# EAGLE board Stepper motor board (EAGLE 9.6.2)
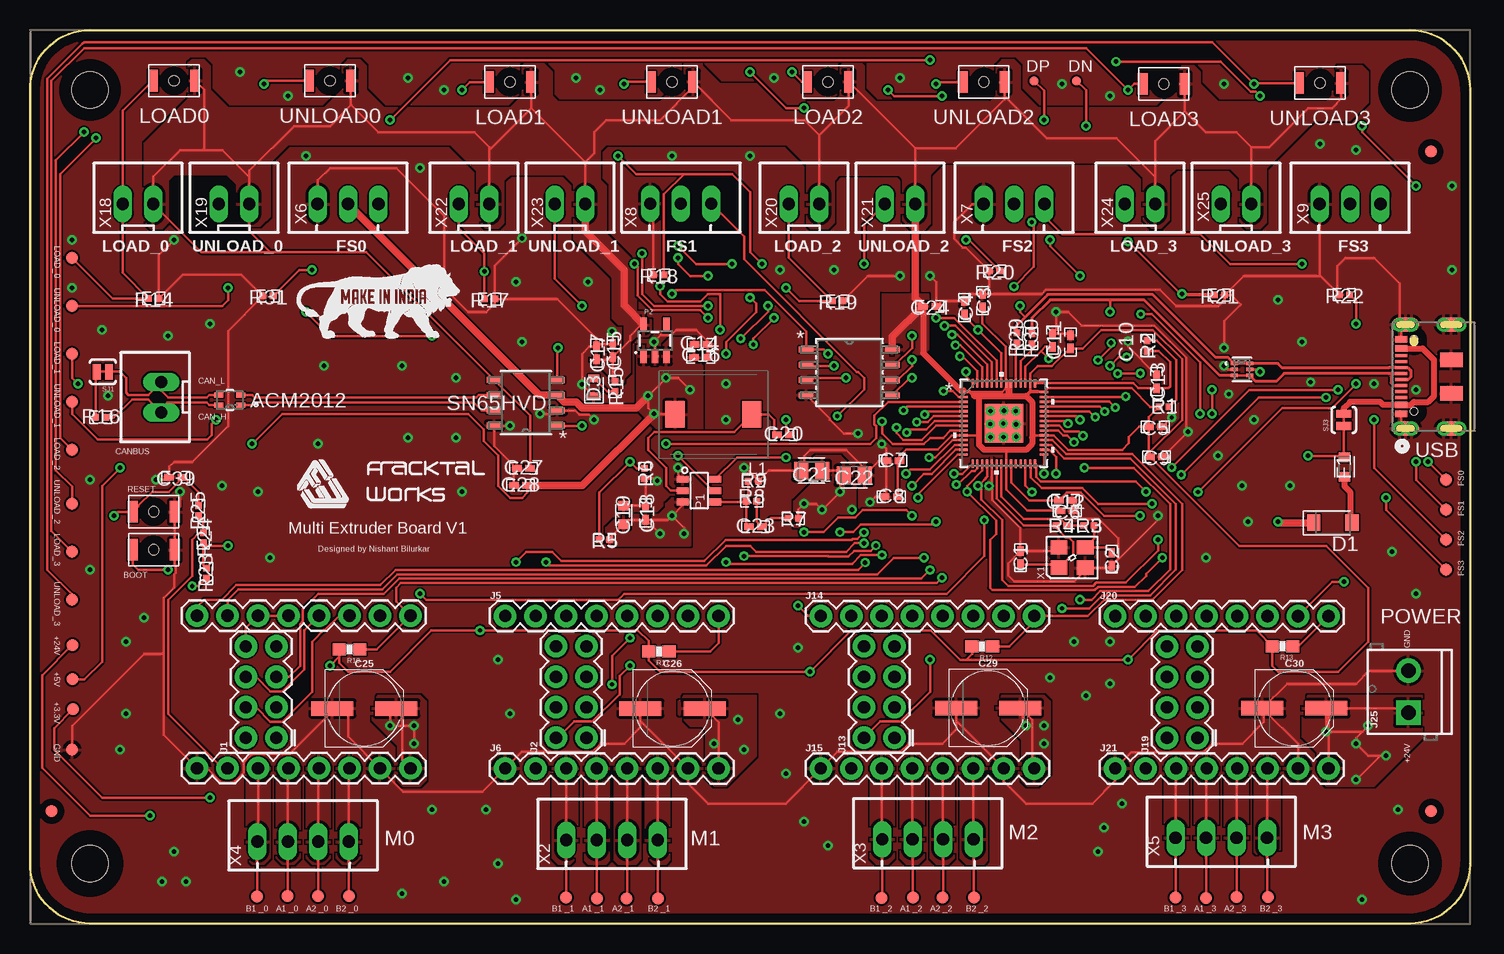
[diagram p2: board, top side]
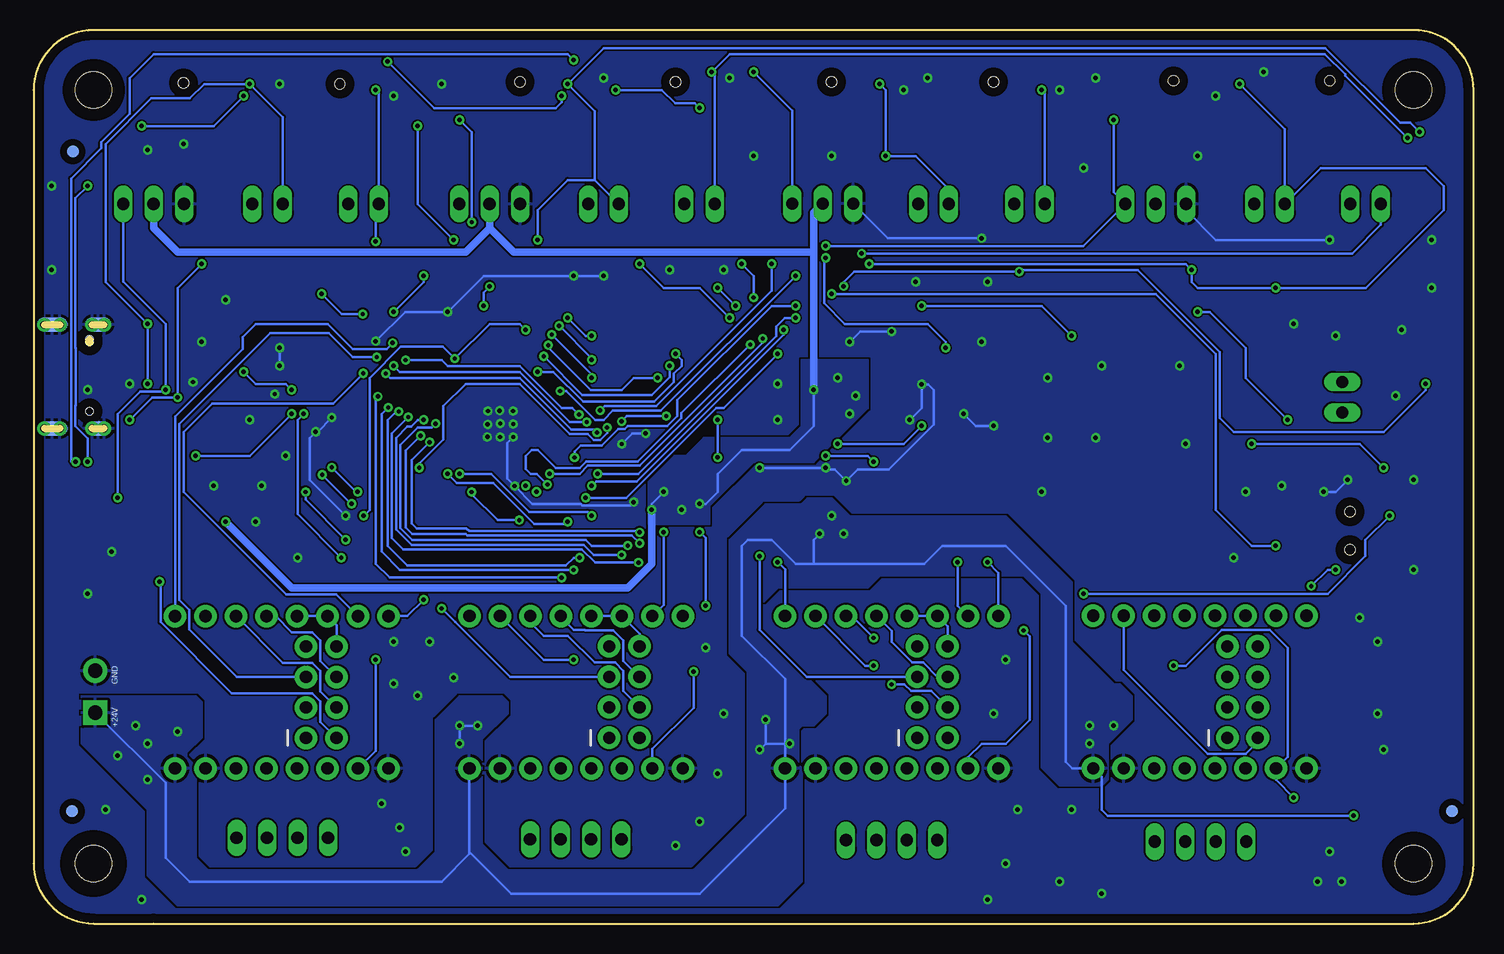
[diagram p3: board, bottom side, seen from below]

Size 120 x 74.5 mm. Coordinates in mm from the lower left corner, seen from the top.
Outline: 115,74.5 arc-90 120,69.5 120,5 arc-90 115,0 110,0 5,0 arc-90 0,5 0,69.5 arc-90 5,74.5 115,74.5
Copper layers (1*16): Top 0.035mm / dielectric 1.5mm / Bottom 0.035mm
Design rules "LionCircuits *": minimum track width 8mil, minimum drill 0.35mm, track to track 6mil, track to pad 6mil, pad to pad 6mil, via to via 6mil, smd to smd 6mil, copper to edge 30mil, drill to drill 10mil, minimum pad ring 10mil, minimum via ring 8mil, stop-mask expansion 4mil, vias tented up to drill 0mil, thermal gap 10mil
Holes 3 mm at 5,69.5 5,5 115,5 115,69.5
tRestrict: area 2.5,67 to 7.5,72; area 112.5,67 to 117.5,72; area 112.5,2.5 to 117.5,7.5; area 2.3,2.3 to 7.7,7.7
bRestrict: area 2.5,67 to 7.5,72; area 112.5,67 to 117.5,72; area 112.3,2.3 to 117.7,7.7; area 2.5,2.5 to 7.5,7.5

## Footprints (pad centres in the part's own frame; a part is rotated, then mirrored left to right if it is on the bottom)
PAD.03X.04 = smd 1.016 x 1.016: P$1 0,0
B3U-1000P(M)-B = smd 0.8 x 1.8: 1 -1.75,0; 2 1.75,0 | hole 0.85: 0,0
CAPC1005X60 = smd 0.79 x 0.54: 1 -0.55,0; 2 0.545,0
CAPC1608X85 = smd 0.8 x 0.9: 1 -0.775,0; 2 0.775,0
CAPC2012X110 = smd 1.165 x 1.465: 1 -0.875,0; 2 0.875,0
PANASONIC_D = smd 3.5 x 1.2: + 2.67,0; - -2.67,0
JST-XH-02-PACKAGE-LONG-PAD = drill 1.016 long: 1 -1.27,0; 2 1.27,0
SODFL3718X115 = smd 1.115 x 1.361: 1 -1.6,0; 2 1.6,0
SOT-666_STM-L = smd 0.583 x 0.28: 1 -0.66,0.5; 2 -0.66,0; 3 -0.66,-0.5; 4 0.66,-0.5; 5 0.66,0; 6 0.66,0.5
LEDC1608X35N_FLAT-G = smd 0.612 x 0.912: A 0.75,0; C -0.75,0
FUSC1608X60N = smd 0.799 x 0.974: 1 -0.815,0; 2 0.815,0
FIDUCIAL_1MM = smd 1 x 1: 1 0,0
PAD.03X.03 = smd 0.762 x 0.762: P$1 0,0
2X4 = drill 1.016 pad 1.88: 1 -3.81,-1.27; 2 -3.81,1.27; 3 -1.27,-1.27; 4 -1.27,1.27; 5 1.27,-1.27; 6 1.27,1.27; 7 3.81,-1.27; 8 3.81,1.27
1X08 = drill 1.016 pad 1.88: 1 0,0; 2 2.54,0; 3 5.08,0; 4 7.62,0; 5 10.16,0; 6 12.7,0; 7 15.24,0; 8 17.78,0
SCREWTERMINAL-3.5MM-2 = drill 1.2 pad 2.032 square: 1 0,0 | drill 1.2 pad 2.032: 2 3.5,0
SMDRI74-680MT = smd 1.6 x 2.2: 1 -3.2,0; 2 3.2,0
ACM2012_TDK = smd 0.762 x 0.406: 1 -0.925,0.406; 2 -0.925,-0.406; 3 0.925,-0.406; 4 0.925,0.406
SOT-23-6 = smd 1 x 0.55: 1 -1.35,0.95; 2 -1.35,0; 3 -1.35,-0.95; 4 1.35,-0.95; 5 1.35,0; 6 1.35,0.95
SOT23-5 = smd 0.55 x 1.2: 1 -0.95,-1.3; 2 0,-1.3; 3 0.95,-1.3; 4 0.95,1.3; 5 -0.95,1.3
RESC1005X40 = smd 0.566 x 0.54: 1 -0.433,0; 2 0.433,0
0603-RES = smd 1.1 x 1: 1 -0.85,0; 2 0.85,0
SJ_2S-TRACE = smd 0.635 x 1.27: 1 -0.508,0; 2 0.508,0
IC57_RP2040-L = smd 0.708 x 0.179: 1 -3.351,2.6; 2 -3.351,2.2; 3 -3.351,1.8; 4 -3.351,1.4; 5 -3.351,1; 6 -3.351,0.6; 7 -3.351,0.2; 8 -3.351,-0.2; 9 -3.351,-0.6; 10 -3.351,-1; 11 -3.351,-1.4; 12 -3.351,-1.8; 13 -3.351,-2.2; 14 -3.351,-2.6; 29 3.351,-2.6; 30 3.351,-2.2; 31 3.351,-1.8; 32 3.351,-1.4; 33 3.351,-1; 34 3.351,-0.6; 35 3.351,-0.2; 36 3.351,0.2; 37 3.351,0.6; 38 3.351,1; 39 3.351,1.4; 40 3.351,1.8; 41 3.351,2.2; 42 3.351,2.6 | smd 0.179 x 0.708: 15 -2.6,-3.351; 16 -2.2,-3.351; 17 -1.8,-3.351; 18 -1.4,-3.351; 19 -1,-3.351; 20 -0.6,-3.351; 21 -0.2,-3.351; 22 0.2,-3.351; 23 0.6,-3.351; 24 1,-3.351; 25 1.4,-3.351; 26 1.8,-3.351; 27 2.2,-3.351; 28 2.6,-3.351; 43 2.6,3.351; 44 2.2,3.351; 45 1.8,3.351; 46 1.4,3.351; 47 1,3.351; 48 0.6,3.351; 49 0.2,3.351; 50 -0.2,3.351; 51 -0.6,3.351; 52 -1,3.351; 53 -1.4,3.351; 54 -1.8,3.351; 55 -2.2,3.351; 56 -2.6,3.351 | smd 3.2 x 3.2: 57 0,0
SOIC_128JVSIQ_WIN-L = smd 1.213 x 0.483: 1 -3.595,1.905; 2 -3.595,0.635; 3 -3.595,-0.635; 4 -3.595,-1.905; 5 3.595,-1.905; 6 3.595,-0.635; 7 3.595,0.635; 8 3.595,1.905
D8-L = smd 1.255 x 0.508: 1 -2.621,1.905; 2 -2.621,0.635; 3 -2.621,-0.635; 4 -2.621,-1.905; 5 2.621,-1.905; 6 2.621,-0.635; 7 2.621,0.635; 8 2.621,1.905
CONN12_KH-TYPE-C-16P = smd 0.52 x 1: 1 -3.1,1.1; 2 -2.35,1.1; 11 2.35,1.1; 12 3.1,1.1 | smd 0.27 x 1: 3 -1.75,1.1; 4 -1.25,1.1; 5 -0.75,1.1; 6 -0.25,1.1; 7 0.25,1.1; 8 0.75,1.1; 9 1.25,1.1; 10 1.75,1.1 | smd 1.2 x 2.2: 13 -4.32,0.725; 14 4.32,0.725 | smd 1.2 x 2.5: 15 -4.32,-3.1; 16 4.32,-3.1 | smd 1.2 x 1.9: 18 -1.4,-3.1; 19 1.4,-3.1 | drill 0.65 pad 0.65: 20 -4.32,1.225; 21 -4.32,0.225; 24 4.32,1.225; 25 4.32,0.225; 26 4.32,-2.45; 27 4.32,-3.75; 28 -4.32,-2.45; 29 -4.32,-3.75 | smd 1.2 x 2.5 bottom: 37 -4.32,-3.1; 41 4.32,-3.1 | smd 1.2 x 2.2 bottom: 39 -4.32,0.725; 43 4.32,0.725 | hole 0.6: -2.9,0; 3.125,0; 2.875,0
CRYSTAL_3225 = smd 1.4 x 1.2: P$1 -1.1,-0.85; P$2 1.1,-0.85; P$3 1.1,0.85; P$4 -1.1,0.85
JST-XH-04-PACKAGE-LONG-PAD = drill 1.016 long: 1 -3.81,0; 2 -1.27,0; 3 1.27,0; 4 3.81,0
JST-XH-03-PACKAGE-LONG-PAD = drill 1.016 long: 1 -2.54,0; 2 0,0; 3 2.54,0

## Placement (x,y rotation side)
1A_0  TEST-POINT3X4  [PAD.03X.04]  21.47,2.29 180 top
1A_1  TEST-POINT3X4  [PAD.03X.04]  47.24,2.08 0 top
1A_2  TEST-POINT3X4  [PAD.03X.04]  73.57,2.15 0 top
1A_3  TEST-POINT3X4  [PAD.03X.04]  98.01,2.13 0 top
1B_0  TEST-POINT3X4  [PAD.03X.04]  18.92,2.25 180 top
1B_1  TEST-POINT3X4  [PAD.03X.04]  44.67,2.16 0 top
1B_2  TEST-POINT3X4  [PAD.03X.04]  70.98,2.12 0 top
1B_3  TEST-POINT3X4  [PAD.03X.04]  95.47,2.15 0 top
2A_0  TEST-POINT3X4  [PAD.03X.04]  24.01,2.29 180 top
2A_1  TEST-POINT3X4  [PAD.03X.04]  49.7,2.08 0 top
2A_2  TEST-POINT3X4  [PAD.03X.04]  76.03,2.15 0 top
2A_3  TEST-POINT3X4  [PAD.03X.04]  100.53,2.22 0 top
2B_0  TEST-POINT3X4  [PAD.03X.04]  26.59,2.29 180 top
2B_1  TEST-POINT3X4  [PAD.03X.04]  52.32,2.08 0 top
2B_2  TEST-POINT3X4  [PAD.03X.04]  78.65,2.15 0 top
2B_3  TEST-POINT3X4  [PAD.03X.04]  103.15,2.22 0 top
3.3V  TEST-POINT3X4  [PAD.03X.04]  3.57,17.86 0 top
5V  TEST-POINT3X4  [PAD.03X.04]  3.53,20.36 0 top
24V  TEST-POINT3X4  [PAD.03X.04]  3.53,23.21 0 top
BOOT  B3U-1000P(M)-B  [B3U-1000P(M)-B]  10.31,31.16 180 top
C1  30pF  [CAPC1005X60]  82.53,30.5 90 top
C2  30pF  [CAPC1005X60]  90.15,30.38 90 top
C3  1uF  [CAPC1005X60]  79.37,51.94 90 top
C4  1uF  [CAPC1005X60]  77.87,51.36 90 top
C5  100nF  [CAPC1005X60]  93.78,41.43 0 top
C6  100nF  [CAPC1005X60]  86.43,34.43 0 top
C7  100nF  [CAPC1005X60]  71.92,38.57 180 top
C8  100nF  [CAPC1005X60]  71.77,35.57 180 top
C9  100nF  [CAPC1005X60]  93.88,38.93 0 top
C10  100nF  [CAPC1005X60]  86.72,48.49 90 top
C11  100nF  [CAPC1005X60]  85.22,48.64 90 top
C12  100nF  [CAPC1005X60]  86.29,35.28 0 top
C13  1uF  [CAPC1005X60]  93.87,45.18 90 top
C14  1uF  [CAPC1005X60]  55.92,48.29 0 top
C15  1uF  [CAPC1005X60]  48.56,47.77 90 top
C16  100nF  [CAPC1005X60]  55.9,47.2 0 top
C17  100nF  [CAPC1005X60]  47.19,47.58 90 top
C18  100nF  [CAPC1005X60]  51.31,34.22 90 top
C19  10uF  [CAPC1608X85]  49.47,34.07 90 top
C20  100nF  [CAPC1005X60]  62.78,40.77 180 top
C21  22uF  [CAPC2012X110]  65.14,37.76 180 top
C22  22uF  [CAPC2012X110]  68.67,37.37 0 top
C23  75pF  [CAPC1005X60]  60.46,33.09 180 top
C24  100nF  [CAPC1005X60]  74.98,51.47 0 top
C25  100uF  [PANASONIC_D]  27.86,17.93 0 top
C26  100uF  [PANASONIC_D]  53.54,17.93 0 top
C27  100nF  [CAPC1005X60]  41.13,37.95 180 top
C28  100nF  [CAPC1005X60]  40.87,36.53 180 top
C29  100uF  [PANASONIC_D]  79.84,17.96 0 top
C30  100uF  [PANASONIC_D]  105.37,17.94 0 top
C39  100nF  [CAPC1005X60]  12.15,37.21 0 top
CANBUS  JST-XH-02-PIN-LONG-PAD  [JST-XH-02-PACKAGE-LONG-PAD]  10.94,43.88 90 top
D1  MBR0520LT1G  [SODFL3718X115]  108.58,33.41 0 top
D2  USBLC6-2P6SOT-666_STM-L  [SOT-666_STM-L]  101,46.2 0 top
D3  LED_G  [LEDC1608X35N_FLAT-G]  46.99,44.72 90 top
F1  FUSE_CHIP-0603(1608-METRIC)  [FUSC1608X60N]  109.54,38.07 90 top
FD1  FIDUCIAL  [FIDUCIAL_1MM]  1.81,9.36 0 top
FD2  FIDUCIAL  [FIDUCIAL_1MM]  116.77,9.36 0 top
FD3  FIDUCIAL  [FIDUCIAL_1MM]  116.73,64.36 0 top
FD4  FIDUCIAL  [FIDUCIAL_1MM]  1.81,9.36 0 bottom
FD5  FIDUCIAL  [FIDUCIAL_1MM]  116.78,9.36 0 bottom
FD6  FIDUCIAL  [FIDUCIAL_1MM]  116.73,64.37 0 bottom
FS0  TEST-POINT3X4  [PAD.03X.04]  118,37 0 top
FS1  TEST-POINT3X4  [PAD.03X.04]  118,34.5 0 top
FS2  TEST-POINT3X4  [PAD.03X.04]  118,32 0 top
FS3  TEST-POINT3X4  [PAD.03X.04]  118,29.5 0 top
GND  TEST-POINT3X4  [PAD.03X.04]  3.5,14.5 0 top
IO1  TEST-POINT3  [PAD.03X.03]  83.66,70.26 0 top
IO2  TEST-POINT3  [PAD.03X.03]  87.2,70.26 0 top
J1  [2X4]  19.26,19.29 90 top
J2  [2X4]  45.1,19.3 90 top
J3  [1X08]  13.92,25.66 0 top
J4  [1X08]  13.92,12.94 0 top
J5  [1X08]  39.6,25.64 0 top
J6  [1X08]  39.6,12.93 0 top
J13  [2X4]  70.77,19.3 90 top
J14  [1X08]  65.9,25.64 0 top
J15  [1X08]  65.9,12.93 0 top
J19  [2X4]  96.02,19.28 90 top
J20  [1X08]  90.43,25.63 0 top
J21  [1X08]  90.43,12.93 0 top
J25  [SCREWTERMINAL-3.5MM-2]  114.86,17.57 90 top
L1  ASPI-0630HI-100M-T157X7X4  [SMDRI74-680MT]  56.95,42.45 180 top
L2  ACM2012  [ACM2012_TDK]  16.65,43.65 180 top
LOAD0  B3U-1000P(M)-B  [B3U-1000P(M)-B]  11.99,70.27 0 top
LOAD1  B3U-1000P(M)-B  [B3U-1000P(M)-B]  40.01,70.16 0 top
LOAD2  B3U-1000P(M)-B  [B3U-1000P(M)-B]  66.49,70.18 0 top
LOAD3  B3U-1000P(M)-B  [B3U-1000P(M)-B]  94.48,70 0 top
LOAD_0  TEST-POINT3X4  [PAD.03X.04]  3.5,55.5 0 top
LOAD_1  TEST-POINT3X4  [PAD.03X.04]  3.5,47.5 0 top
LOAD_2  TEST-POINT3X4  [PAD.03X.04]  3.5,39.5 0 top
LOAD_3  TEST-POINT3X4  [PAD.03X.04]  3.5,31 0 top
P1  TPS54202_BUCKCONV  [SOT-23-6]  55.76,36.09 0 top
P2  3.3V  [SOT23-5]  52.09,48.61 0 top
R1  200R  [RESC1005X40]  94.51,43.07 180 top
R2  1R  [RESC1005X40]  93.07,48.17 90 top
R3  1K  [RESC1005X40]  88.24,33.19 180 top
R4  NO-FIT  [RESC1005X40]  85.95,33.19 180 top
R5  511k  [RESC1005X40]  47.87,32 0 top
R6  105k  [RESC1005X40]  51.22,37.52 90 top
R7  49.9R  [RESC1005X40]  63.61,33.8 0 top
R8  100k  [RESC1005X40]  60.13,35.23 0 top
R9  13.3k  [RESC1005X40]  60.28,36.89 180 top
R10  10K  [0603-RES]  26.62,22.86 180 top
R11  10K  [0603-RES]  52.4,22.68 180 top
R12  10K  [0603-RES]  79.35,23.09 180 top
R13  10K  [0603-RES]  104.38,23.12 180 top
R14  10K  [RESC1005X40]  10.3,52.12 0 top
R15  49.9R  [RESC1005X40]  48.74,44.78 90 top
R16  120R  [RESC1005X40]  5.89,42.2 180 top
R17  10K  [RESC1005X40]  38.3,52.07 0 top
R18  10k  [RESC1005X40]  52.38,54.07 0 top
R19  10K  [RESC1005X40]  67.3,51.9 0 top
R20  10k  [RESC1005X40]  80.38,54.4 0 top
R21  10K  [RESC1005X40]  99.12,52.4 0 top
R22  10k  [RESC1005X40]  109.53,52.43 0 top
R23  1K  [RESC1005X40]  14.71,29.2 270 top
R24  DO NOT FIT (10K)  [RESC1005X40]  14.44,32.15 90 top
R25  100k  [RESC1005X40]  14.06,34.42 270 top
R29  27.4R  [RESC1005X40]  82.24,48.83 270 top
R30  27.4R  [RESC1005X40]  83.49,48.76 270 top
R31  10k  [RESC1005X40]  19.84,52.32 0 top
RESET  B3U-1000P(M)-B  [B3U-1000P(M)-B]  10.31,34.32 180 top
SJ1  SOLDERJUMPERTRACE  [SJ_2S-TRACE]  6.07,46 180 top
SJ3  SOLDERJUMPERTRACE  [SJ_2S-TRACE]  109.49,41.99 90 top
U1  RP2040IC57_RP2040-L  [IC57_RP2040-L]  81.15,41.7 0 top
U2  W25Q128JVSIQSOIC_128JVSIQ_WIN-L  [SOIC_128JVSIQ_WIN-L]  68.28,45.95 0 top
U3  SN65HVD  [D8-L]  41.32,43.42 180 top
U$2  [MAKEININDIA]  23.21,48.08 0 top
U$3  [FWLOGO_SMALL]  22,33.5 0 top
UNLOAD0  B3U-1000P(M)-B  [B3U-1000P(M)-B]  25,70.27 0 top
UNLOAD1  B3U-1000P(M)-B  [B3U-1000P(M)-B]  53.51,70.17 0 top
UNLOAD2  B3U-1000P(M)-B  [B3U-1000P(M)-B]  79.48,70.17 0 top
UNLOAD3  B3U-1000P(M)-B  [B3U-1000P(M)-B]  107.52,70.08 0 top
UNLOAD_0  TEST-POINT3X4  [PAD.03X.04]  3.5,51.5 0 top
UNLOAD_1  TEST-POINT3X4  [PAD.03X.04]  3.5,43.5 0 top
UNLOAD_2  TEST-POINT3X4  [PAD.03X.04]  3.5,35 0 top
UNLOAD_3  TEST-POINT3X4  [PAD.03X.04]  3.5,27 0 top
USB  USB-C(KH-TYPE-C-16P)  [CONN12_KH-TYPE-C-16P]  115.35,45.6 90 top
X1  CRYSTAL_TAXM12M4RLBDDT2T_3225  [CRYSTAL_3225]  86.84,30.5 0 top
X2  JST-XH-04-PIN-LONG-PAD  [JST-XH-04-PACKAGE-LONG-PAD]  48.49,6.95 0 top
X3  JST-XH-04-PIN-LONG-PAD  [JST-XH-04-PACKAGE-LONG-PAD]  74.82,7.02 0 top
X4  JST-XH-04-PIN-LONG-PAD  [JST-XH-04-PACKAGE-LONG-PAD]  22.76,6.83 0 top
X5  JST-XH-04-PIN-LONG-PAD  [JST-XH-04-PACKAGE-LONG-PAD]  99.28,7.14 0 top
X6  JST-XH-03-PIN-LONG-PAD  [JST-XH-03-PACKAGE-LONG-PAD]  26.5,60 0 top
X7  JST-XH-03-PIN-LONG-PAD  [JST-XH-03-PACKAGE-LONG-PAD]  82,60 0 top
X8  JST-XH-03-PIN-LONG-PAD  [JST-XH-03-PACKAGE-LONG-PAD]  54.24,60.01 0 top
X9  JST-XH-03-PIN-LONG-PAD  [JST-XH-03-PACKAGE-LONG-PAD]  110,60 0 top
X18  JST-XH-02-PIN-LONG-PAD  [JST-XH-02-PACKAGE-LONG-PAD]  9,60 0 top
X19  JST-XH-02-PIN-LONG-PAD  [JST-XH-02-PACKAGE-LONG-PAD]  17,60 0 top
X20  JST-XH-02-PIN-LONG-PAD  [JST-XH-02-PACKAGE-LONG-PAD]  64.5,60 0 top
X21  JST-XH-02-PIN-LONG-PAD  [JST-XH-02-PACKAGE-LONG-PAD]  72.5,60 0 top
X22  JST-XH-02-PIN-LONG-PAD  [JST-XH-02-PACKAGE-LONG-PAD]  37,60 0 top
X23  JST-XH-02-PIN-LONG-PAD  [JST-XH-02-PACKAGE-LONG-PAD]  45,60 0 top
X24  JST-XH-02-PIN-LONG-PAD  [JST-XH-02-PACKAGE-LONG-PAD]  92.5,60 0 top
X25  JST-XH-02-PIN-LONG-PAD  [JST-XH-02-PACKAGE-LONG-PAD]  100.5,60 0 top

## Tracks (layer width: path | path; a pad name or v marks a point on that pad's centre or on a via)
1A_0
  Top 0.203: 1A_0.P$1 21.49,2.32 X4.2 21.49,12.89 J4.4
  pour Top: 22,14 21,14 20.5,13.5 20.5,5.5 21,5 22,5 22.5,5.5 22.5,13.5
1A_1
  Top 0.203: 1A_1.P$1 47.22,2.09 X2.2 J6.4
  pour Top: 48,14 46.86,14 46.24,13.37 46.24,5.26 46.5,5 48,5 48.28,5.28 48.28,13.72
1A_2
  Top 0.203: 1A_2.P$1 73.55,2.17 X3.2 73.52,7.04 J15.4
  pour Top: 74,14 73,14 72.5,13.5 72.5,5.5 73,5 74,5 74.5,5.5 74.5,13.5
1A_3
  Top 0.203: 1A_3.P$1 X5.2 98,12.88 J21.4
  pour Top: 98.5,14 97.5,14 97,13.5 97,6 97.5,5.5 98.5,5.5 99,6 99,13.5
1B_0
  Top 0.203: 1B_0.P$1 18.95,2.28 X4.1 19,6.88 J4.3
  pour Top: 19.5,14 18.5,14 18,13.5 18,5.5 18.5,5 19.5,5 20,5.5 20,13.5
1B_1
  Top 0.203: 1B_1.P$1 44.68,2.18 X2.1 J6.3
  pour Top: 45,14 44,14 43.5,13.5 43.5,5.5 44,5 45,5 45.65,5.65 45.65,13.35
1B_2
  Top 0.203: 1B_2.P$1 71.01,2.15 X3.1 70.98,7.04 J15.3
  pour Top: 71.5,14 70.5,14 70,13.5 70,5.5 70.5,5 71.5,5 72,5.5 72,13.5
1B_3
  Top 0.203: 1B_3.P$1 X5.1 95.47,12.88 J21.3
  pour Top: 96,14 95,14 94.5,13.5 94.5,6 95,5.5 96,5.5 96.5,6 96.5,13.5
2A_0
  Top 0.203: 2A_0.P$1 24.03,2.32 X4.3 24.03,12.89 J4.5
  pour Top: 24.5,14 23.5,14 23,13.5 23,5.5 23.5,5 24.5,5 25,5.5 25,13.5
2A_1
  Top 0.203: 2A_1.P$1 49.76,2.15 X2.3 J6.5
  pour Top: 50.5,14 49,14 48.67,13.67 48.67,5.33 49,5 50.5,5 50.89,5.39 50.89,13.61
2A_2
  Top 0.203: 2A_2.P$1 76.09,2.21 X3.3 76.06,7.04 J15.5
  pour Top: 76.5,14 75.5,14 75,13.5 75,5.5 75.5,5 76.5,5 77,5.5 77,13.5
2A_3
  Top 0.203: 2A_3.P$1 100.55,2.24 X5.3 100.55,12.88 J21.5
  pour Top: 101,14 100,14 99.5,13.5 99.5,6 100,5.5 101,5.5 101.5,6 101.5,13.5
2B_0
  Top 0.203: 2B_0.P$1 26.57,2.3 X4.4 26.57,12.89 J4.6
  pour Top: 27,14 26,14 25.5,13.5 25.5,5.5 26,5 27,5 27.5,5.5 27.5,13.5
2B_1
  Top 0.203: 2B_1.P$1 52.3,2.09 X2.4 J6.6
  pour Top: 53,14 51.5,14 51.26,13.76 51.26,5.74 52,5 53,5 53.29,5.29 53.29,13.71
2B_2
  Top 0.203: 2B_2.P$1 78.63,2.17 X3.4 78.6,7.04 J15.6
  pour Top: 79.5,14 78,14 77.5,13.5 77.5,5.5 78,5 79.5,5 79.79,5.29 79.79,13.71
2B_3
  Top 0.203: 2B_3.P$1 103.08,2.29 X5.4 103.08,12.88 J21.6
  pour Top: 103.5,14 102.5,14 102,13.5 102,6 102.5,5.5 103.5,5.5 104.2,6.2 104.2,13.3
+1.1V  (via drill 0.35)
  Top 0.203: U1.45 82.95,46.45 84.25,47.75 | C11.1 84.59,48.09 84.25,47.75 | U1.50 80.95,47.55 v79,49.5 77.87,50.63 C4.1 | U1.23 81.75,36.79 83.26,35.28 C12.1 86.4,35.94 87.56,35.94 89.5,34 v92.5,34 | v84.9,47.1 84.25,47.75
  Bottom 0.203: v79,49.5 79.5,50 82,50 v84.9,47.1 85.9,48.1 89.4,48.1 92,45.5 92,34.5 v92.5,34
+3.3V  (via drill 0.35)
  Top 0.203: 83.5,40.5 83.7,40.7 U1.33 85.3,40.7 86.5,39.5 91,39.5 91.54,40.04 91.54,40.54 92.43,41.43 C5.1 | 81.5,39.5 81.35,39.35 U1.22 81.35,37.69 81.35,36.19 83.11,34.43 C6.1 | 79.09,40.41 78.8,40.7 U1.10 76.8,40.7 75.63,39.53 73.03,39.53 72.45,38.95 72.45,38.55 | C3.1 79.37,50.02 81.31,48.09 81.31,45.39 81.64,45.06 | U1.49 81.45,44.96 | U1.48 | U1.48 81.64,45.06 | C5.1 93.23,39.03 C9.1 | C8.1 72.32,38.42 72.45,38.55 | 72.45,38.55 C7.1 | C5.1 93.23,42.22 R1.2 93.37,43.07 91.81,44.63 84.83,44.63 U1.42 84.46,44.35 84,44.35 | C9.1 93.33,39.33 96,42 96,47.04 93.54,49.5 89.28,49.5 87.72,47.94 C10.1 86.64,47.94 85.16,46.47 83.97,46.47 83.35,45.85 U1.44 83.35,44.49 83.5,44.35 | C9.1 100.76,31.5 108,31.5 111.5,28 111.5,23.5 109,21 104,21 103.53,21.47 R13.2 102.22,24.44 93.94,24.44 v91.5,22 78,22 | 78,22 77.5,22 75.05,24.45 68.45,24.45 v65,21 52.5,21 51.55,21.95 R11.2 51.55,23.55 50.65,24.45 v37.5,24.45 33.45,24.45 30,21 26.5,21 25.77,21.73 R10.2 25.77,22.27 v25,21.5 | 78,22 78.5,22.5 R12.2 | C27.1 41.68,42.35 U3.5 28.03,56 20,56 | R25.2 14.44,33.61 R24.2 14.08,32.58 13.5,32 13.5,29 11.5,27 11.5,17.5 16.06,12.94 J4.2 | 20,56 18.27,57.73 X19.2 18.27,62.23 | 20,56 14.27,56 X18.2 10.27,62.27 12.5,64.5 14.5,64.5 | 14.5,64.5 16,64.5 18.27,62.23 | 18.27,62.23 18.27,62.77 22,66.5 25,66.5 26.75,68.25 | LOAD0.2 14.5,69.51 14.5,64.5 | 26.75,68.25 UNLOAD0.2 | 26.75,68.25 29,66 37,66 38.27,64.73 38.27,64.5 | 38.27,64.5 X22.2 | 38.27,64.5 41.76,67.99 41.76,68 | 41.76,68 LOAD1.2 | 41.76,68 46.27,63.49 | 46.27,63.49 X23.2 | 46.27,63.49 47,64.22 47,66 48,67 52.5,67 55.26,69.76 UNLOAD1.2 58.43,67 64.5,67 65.77,65.73
  Top 0.203: 65.77,65.73 X20.2 | 65.77,65.73 68.24,68.2 LOAD2.2 73.77,64.66 | 73.77,64.66 X21.2 | 73.77,64.66 77.16,64.66 81.23,68.73 81.23,69 | 81.23,69 UNLOAD2.2 | 81.23,69 84.73,65.5 90.5,65.5 93.75,62.25 | 93.75,62.25 93.77,62.23 X24.2 | 93.75,62.25 93.75,65.25 96.23,67.73 | LOAD3.2 96.23,67.73 | 96.23,67.73 97.97,66 100.5,66 101.75,64.75 | 101.75,64.75 101.77,64.73 X25.2 | 101.75,64.75 103.25,64.75 106.5,68 108.5,68 109.27,68.77 UNLOAD3.2 | 3.3V.P$1 2,16.29 2,14.5 6,10.5 v15,10.5 | 77.8,44.45 77.7,44.35 77.65,44.35 | 81.64,45.06 81.3,44.71 81.3,44.6 81,44.3 U1.1 | C17.1 48.36,47.02 C15.1 | C15.1 48.56,45.4 R15.2 | C15.1 50,48.66 50,49 50.91,49.91 P2.5
  Top 0.305: 84,44.35 83.5,44.35 83.36,44.35 83.35,44.35 83,44 | 78.65,44 78.3,44.35 77.65,44.35 77.55,44.45
  Top 0.406: 81.45,44.96 81.5,44.91 81.5,44 81.64,44.14 81.64,45.06
  Top 0.508: C24.1 74.43,47.57 77.55,44.45 77.8,44.45 | 79,44 81.5,44 83,44 83.5,43.5 83.5,40.5 83.5,40 83,39.5 81.5,39.5 79.51,39.5 79.09,39.91 79.09,40.41 79.09,43.91 79,44 | 78.65,44 79,44
  Top 0.61: P2.5 49.5,51.55 49.5,54.5 46.27,57.73 X23.2 | X21.2 73.77,52.13 C24.1 71.88,48.92 U2.8
  Bottom 0.203: v25,21.5 24,21.5 21,24.5 19.53,24.5 19.5,24.47 16.97,24.47 15.5,23 15.5,13.9 J4.2 16.46,11.96 v15,10.5 | v37.5,24.45 37,23.95 37,17 39,15 41,15 42.14,13.86 J6.2 | v65,21 65,18 68.44,14.56 J15.2 | v91.5,22 91.5,14.4 J21.2
  pour Top: 47,46.5 47.5,46.5 48.31,45.69 48.31,44.96 48.47,44.8 49.12,44.8 49.5,45.18 49.5,45.5 50,46 50,48.5 50.5,49 51.5,49 51.77,49.27 51.77,50.33 51.1,51 50.5,51 49.5,50 49.5,48 49.19,47.69 48.3,47.69 48.1,47.49 46.86,47.49 46.69,47.32 46.69,46.61 46.8,46.5 47,46.5 47,46.5
  pour Top: 13.5,72 13.18,71.68 13.18,68.72 9.5,65.04 9.5,58.5 10,58 11,58 11.5,58.5 11.5,62 12,62.5 16.4,62.5 17.25,61.66 17.25,58.84 17.91,58.18 19.18,58.18 20,59 20,63.5 21.5,65 35,65 37.22,62.78 37.22,58.76 37.95,58.02 39.05,58.02 39.46,58.44 39.46,61.96 40,62.5 44.5,62.5 45.3,61.7 45.3,58.67 45.98,58 46.5,58 47.5,59 47.5,64.5 48,65 63,65 64.72,63.28 64.72,58.3 65.02,58 66.5,58 67,58.5 67,62 67.42,62.42 72.39,62.42 72.72,62.09 72.72,58.66 73.51,57.87 74.52,57.87 75.03,58.38 75.03,62.47 75,62.5 76,63.5 91.5,63.5 92.79,62.21 92.79,58.68 93.42,58.04 94.26,58.04 94.92,58.7 94.92,62.42 95.5,63 100,63 100.8,62.2 100.8,58.56 101.36,58 102.5,58 103,58.5 103,63 107,67 110,67 111.5,68.5 111.5,71 111,71.5 109,71.5 108.5,71 108.5,69 108,68.5 99,68.5 97.5,70 97.5,71 97,71.5 96,71.5 95.5,71 95.5,69.5 94,68 84,68 82.5,69.5 82.5,71.5 82,72 81,72 80.5,71.5 80.5,69 80,68.5 70.5,68.5 69.5,69.5 69.5,71.5 69,72 68,72 67.5,71.5 67.5,69 67,68.5 64,68.5 62.5,70 57.5,70 56,71.5 56,72 55.5,72.5 55,72.5 54.5,72 54.5,70.5 52.5,68.5 44,68.5 43.5,69 43.5,71 42.5,72 41.5,72 41,71.5 41,69 40,68 29.5,68 28,69.5 28,71.5 27.5,72 26.5,72 26,71.5 26,69.5 24.5,68 16.5,68 15,69.5 15,71.5 14.5,72
  pour Top: 49.5,50 50.5,51 50.5,55 48,57.5 48,61.5 47,62.5 46,62.5 45.3,61.8 45.3,59.76 45.3,57.08 45.48,56.91 48.5,53.89 48.5,51.5 48.5,50.5 49,50
  pour Top: 71,52.5 71,47.5 74.5,47.5 74.89,47.89 74.89,52.42
+5V  (via drill 0.35)
  Top 0.203: 5V.P$1 4.53,20.36 6,21.83 6,36.5 v7.5,38 | R7.2 64.04,34.54 v64.5,35 65.5,35 v66,34.5 v67.5,36 67.5,37.08 67.71,37.29 | 67.71,37.29 C22.1 | C21.1 67.24,37.76 67.71,37.29 | L1.2 53.7,42.5 v52,42.5 51.5,43 v51.5,44 v53,45.5 54,45.5 v55,44.5 | v18.5,40 21,42.5 36.5,42.5 37.82,41.18 37.82,40.21 39,39.03 39,36.5 40,35.5 41,35.5 41.42,35.92 C28.1
  Top 0.61: D1.1 104.09,33.41 v104,33.5 | X6.2 27.77,58.73 27.77,58.71 42.42,44.06 U3.3 44.5,43.5 45.5,43.5 46,43 50.5,43 v51.5,44 | v52,42.5 46.03,36.53 C28.1
  Bottom 0.203: v7.5,38 9.5,40 v18.5,40 | v55,44.5 55,41.5 57,39.5 61,39.5 63,37.5 63,36 64,35 v64.5,35 | v67.5,36 68.5,35 v68.5,34.5
  Bottom 0.61: v104,33.5 98.5,28 70.5,28 68.5,30 v68.5,34.5 | v55,44.5 55,56 | 55,56 55,59.25 X8.2 | 55,56 80,56 82,58 | 82,58 X7.2 | 82,58 84,56 108,56 110,58 X9.2
  pour Top: 55.91,46.56 55.91,48.74 55.83,48.82 53.35,48.82 52.68,48.15 52.68,46.6 52.36,46.28 51.68,46.28 51.54,46.42 51.54,48.1 51.57,48.13 50.62,48.13 50.62,42.88 53,40.5 56,40.5 56,46.5
  pour Bottom: 56,47 50.5,47 50.5,43 55,38.5 60,38.5 63.7,34.8 63.7,33.3 68.75,33.3 68.75,37.25 67,39 65.67,39 64.17,40.5 57,40.5 56,41.5
  pour Top: 65.5,39 65.33,38.83 65.33,36.83 63.68,35.18 63.68,33.07 68.77,33.07 68.77,36.73 68.5,37 68.5,38 67.5,39
+24V  (via drill 0.35)
  Top 0.203: J21.8 108.21,17.77 C30.+ | C30.+ 114.49,17.94 J25.1 | J15.8 83.51,13.1 83.51,16.96 82.73,17.73 | 82.73,17.73 C29.+ | C26.+ 57.38,16.76 J6.8 57.38,14.62 v57,15 | J4.8 31,13.64 31,17.46 C25.+ 30,17.4 v30,16.5 v32,16.5 v32,15 | R5.2 48.31,32.13 C19.1 49.84,33.67 C18.1 | C18.1 53.17,33.67 v53.5,34 | v53.5,34 54.41,34.91 P1.3 | v53.5,34 54.5,33 v54.5,32.5 | v52.5,32.5 51.33,33.67 C18.1 | v83,16.5 82.73,16.77 82.73,17.73 | v110.5,12 112.5,14 v113,14 111.5,14 v110.5,15 110.5,15.5 v111.5,16.5 111,16 v108,16 108.04,16.04 C30.+ | 24V.P$1 1,20.68 1,13 5,9 v10,9
  Bottom 0.203: J25.1 109,11.71 109,5.5 107,3.5 86,3.5 83.68,5.82 83.68,6 | 83.68,6 J15.8 | 83.68,6 80.18,2.5 64.5,2.5 57.38,9.62 J6.8 57.38,20.38 61,24 61,31.5 60.5,32 58.5,32 56.5,30 55,30 | 55,30 45.77,30 44.27,31.5 39,31.5 34,26.5 34,13.5 33.44,12.94 J4.8 31,12.24 31,9.5 30.5,9 v10,9 | v54.5,32.5 55,32 55,30 | v57,15 59,15 | v59.5,14.5 59,15 | 59,15 v59,17 | v83,16.5 v84.5,16.5 v84.5,15
  pour Top: 116,19 106.5,19 106,18.5 106,15.6 107.29,14.31 107.29,12.21 108,11.5 112,11.5 116,15.5
  pour Top: 84.5,19 81,19 80.5,18.5 80.5,17.5 82.64,15.36 82.64,11.95 83.09,11.5 84,11.5 85,12.5 85,18.5
  pour Top: 60.5,19 54.5,19 54,18.5 54,17.5 55,16.5 56,16.5 56.31,16.19 56.31,12.19 57,11.5 58,11.5 60.5,14
  pour Top: 32.5,19 29,19 28.5,18.5 28.5,17 30.65,14.85 30.65,11.85 31,11.5 32.5,11.5 33,12 33,18.5
  pour Top: 55,31.5 48,31.5 48,33 49,34 50,34 50.1,34.1 52.42,34.1 53,34.68 53,35 53.5,35.5 55,35.5
  pour Bottom: 30.5,15 30.5,12 31,11.5 34.5,11.5 36,13 36,27.5 37.5,29 49.5,29 50.5,28 54,28 55.5,29.5 55.5,34 56,34.5 56,35 55.5,35.5 53.5,35.5 52,34 39,34 33.5,28.5 33.5,23.5 30,20 29.5,20 28.5,19 28.5,17
  pour Bottom: 54,28 58,28 59.5,26.5 59.5,24.5 54,19 54,17.5 55,16.5 56,16.5 56.3,16.2 56.3,12.05 56.85,11.5 58.5,11.5 60.5,13.5 60.5,21 62,22.5 62,32 59,35 56,35 56,34.5 55.5,34 55.5,29.5
  pour Bottom: 56,13 56,3.5 58,1.5 108,1.5 110.5,4 110.5,9.5 116,15 116,19 106.5,19 106,18.5 106,15.5 107.28,14.22 107.28,13.9 106.5,13.12 106.5,5.5 105.5,4.5 88,4.5 86.5,6 86.5,17 84.5,19 81,19 80.5,18.5 80.5,17.5 82.66,15.34 82.66,6.66 80.5,4.5 65,4.5 60.5,9 60.5,13.5 60,14 57,14
ADC_AVDD
  Top 0.203: U1.43 91.94,45.06 92.37,44.63 C13.1 94.87,44.63 95,44.76 95,46.81 94.07,47.74 R2.1
ADC_R
  Top 0.203: R1.1 95.5,43.63 95.5,47 93.9,48.6 R2.2
BCBOOT  (via drill 0.35)
  Top 0.203: P1.6 58.94,38.87 v63,38.87 | v63,42 63,41.09 C20.1
  Bottom 0.203: v63,38.87 v63,42
CAN1_N
  Top 0.203: L2.2 18.53,44.05 18.74,43.85 37.17,43.85 37.38,44.06 U3.6
CAN1_P
  Top 0.203: L2.1 18.53,43.24 18.73,43.44 36.97,43.44 37.63,42.79 U3.7
CAN_N
  Top 0.203: L2.3 14.94,44.05 14.73,43.85 11.52,43.85 10.94,44.44 CANBUS.2 9.85,44.06 8.2,44.06 8,44.26 8,45.5 7.5,46 SJ1.1
CAN_P
  Top 0.203: L2.4 14.94,43.24 14.73,43.44 11.44,43.44 10.94,42.94 CANBUS.1 9.85,43.71 8.5,43.71 7,42.2 R16.1
CAN_RX  (via drill 0.35)
  Top 0.203: U3.4 43.95,47.95 v44,48 | v76.12,44.4 76.89,44.4 77.38,43.9 U1.2 | v54,55.5 54,55 55,54 v56.5,54
  Bottom 0.203: v76.12,44.4 75.6,44.4 73.21,42 72.5,42 71.75,42.75 67.75,42.75 v56.5,54 | v54,55.5 54.13,55.37 54.13,51.74 52.39,50 45.5,50 44,48.5 v44,48
CAN_TX  (via drill 0.35)
  Top 0.203: U1.3 71.5,43.5 70.37,42.37 70.37,41.61 70.5,41.47 70.5,40.5 70,40 v53,40 | v46,41.5 43.96,41.5 U3.1
  Bottom 0.203: v53,40 47.5,40 v46,41.5
CNT
  Top 0.203: R16.2 5.46,45.73 5.33,45.86 5.33,46 SJ1.2
E0_DIR  (via drill 0.35)
  Top 0.203: U1.38 88.28,42.7 v88.77,42.22 | v69.59,30.09 69,29.5 30.49,29.5 29.2,28.21 17.21,28.21 16,27 14.5,27 13.92,26.42 J3.1
  Bottom 0.203: v69.59,30.09 73.2,30.09 74.3,31.2 89.2,31.2 90.14,32.14 90.14,40.84 v88.77,42.22
E0_EN  (via drill 0.35)
  Top 0.203: U1.41 91.25,43.91 v91.3,43.95 | v76,28.84 75.57,28.4 30.9,28.4 30.5,28 30.5,26.87 J3.8 28.9,22.86 R10.1
  Bottom 0.203: v91.3,43.95 91.5,43.76 91.5,30 90.33,28.84 v76,28.84
E0_STEP  (via drill 0.35)
  Top 0.203: U1.39 89.16,43.1 v89.57,42.7 | v74.5,30.5 71.99,30.5 70.61,29.11 30.61,29.11 29.35,27.86 17.36,27.86 16.46,26.96 J3.2
  Bottom 0.203: v89.57,42.7 89.78,42.7 90.5,41.97 90.5,31.5 88.84,29.84 75.66,29.84 75,30.5 v74.5,30.5
E0_UART  (via drill 0.35)
  Top 0.203: U1.40 89.96,43.51 v90.45,43.02 | v75,29.47 74.97,29.47 74.26,28.76 30.76,28.76 29.5,27.5 24,27.5 22.74,26.24 22.74,25.17 22.5,24.93 22.5,21.5 21.56,20.56 J1.5
  Bottom 0.203: v90.45,43.02 91,42.46 91,31 89.48,29.49 75.02,29.49 v75,29.47
E1_DIR  (via drill 0.35)
  Top 0.203: U1.34 85.67,41.1 86.09,40.69 86.45,40.69 v87,40.13 | v69.5,32.62 68.95,32.07 68.56,32.07 68.5,32 58,32 56.21,30.21 44.29,30.21 43.5,31 41.37,31 v40.5,30.13
  Bottom 0.203: v87,40.13 88.5,38.63 88.5,33.36 88.07,32.93 83.92,32.93 83.71,32.71 69.59,32.71 v69.5,32.62 | v40.5,30.13 39.6,29.23 J5.1
E1_EN  (via drill 0.35)
  Top 0.203: U1.37 87.19,42.3 v87.5,42 | v71,30.72 69.22,30.72 68.5,30 58.13,30 v58,30.13 | R11.1 56.68,22.68 57.38,23.38 J5.8
  Bottom 0.203: v87.5,42 87.97,42 88.54,41.43 88.86,41.43 89.79,40.5 89.79,32.84 88.5,31.55 74.16,31.55 73.33,30.72 v71,30.72 | v58,30.13 57.38,29.51 J5.8
E1_STEP  (via drill 0.35)
  Top 0.203: v87.75,40.67 87.38,41.04 86.24,41.04 85.77,41.51 U1.35 | v69.5,31.71 68.71,31.71 68,31 60.5,31 60,31.5 58,31.5 56.36,29.86 43.28,29.86 v43,30.13
  Bottom 0.203: v87.75,40.67 88.97,39.45 88.97,33.03 88.44,32.5 84,32.5 83.86,32.36 70.14,32.36 v69.5,31.71 | v43,30.13 43,26.5 J5.2
E1_UART  (via drill 0.35)
  Top 0.203: U1.36 86.27,41.91 v86.5,41.67 | v70.5,31.5 70.07,31.08 68.67,31.08 68.21,30.62 66.53,30.62 66.52,30.63 v59.5,30.63
  Bottom 0.203: v86.5,41.67 86.82,41.35 87.99,41.35 89.43,39.91 89.43,32.99 88.44,32 74,32 73.5,31.5 v70.5,31.5 | v59.5,30.63 59.5,24.5 55.57,20.57 J2.5
E2_DIR  (via drill 0.35)
  Top 0.203: J14.1 64.86,25.64 v64,26.5 | v64.5,32.63 66.13,32.63 67.37,33.87 68.76,33.87 69.39,34.5 73,34.5 v73.5,34 | v84.5,37.5 U1.29
  Bottom 0.203: v64,26.5 64,32.13 v64.5,32.63 | v84.5,37.5 81.87,37.5 78.7,34.33 73.83,34.33 v73.5,34
E2_EN
  Top 0.203: U1.32 85.19,40.3 86.35,39.14 91.86,39.14 96,35 96,29.5 93.5,27 89.5,27 88.14,25.64 J14.8 83.68,25.18 81.59,23.09 R12.1
E2_STEP  (via drill 0.35)
  Top 0.203: U1.30 84.55,39.46 84.95,39.46 85.5,38.91 v85.5,37.5 | v67.5,32.63 68.62,32.63 69.24,33.25 75.5,33.25 v75.5,33.5
  Bottom 0.203: v85.5,37.5 84.74,36.74 81.71,36.74 78.28,33.31 75.69,33.31 v75.5,33.5 | v67.5,32.63 67.5,26.58 J14.2
E2_UART  (via drill 0.35)
  Top 0.203: U1.31 85.09,39.91 86.2,38.79 91.71,38.79 95.5,35 95.5,29.5 93.35,27.36 89.35,27.36 88.27,26.27 v86,26.27
  Bottom 0.203: v86,26.27 84.87,25.15 | 84.87,25.15 | 84.87,25.15 80.3,20.57 J13.5
E3_DIR  (via drill 0.35)
  Top 0.203: v72.21,41.34 72.21,40.9 72.79,40.32 74.32,40.32 75.51,41.51 77.77,41.51 U1.8 | v87.87,38 91.99,38 95,34.99 95,29.51 93.2,27.71 89.2,27.71 88.49,27 v87.5,27
  Bottom 0.203: v72.21,41.34 72.21,40.9 72.79,40.32 73.31,40.32 73.81,40.82 75.33,40.82 79.5,45 84,45 85.87,43.13 85.87,40.37 87.87,38.37 v87.87,38 | v87.5,27 88.87,25.63 J20.1
E3_EN  (via drill 0.35)
  Top 0.203: U1.5 74.81,42.7 v74.55,42.45 | v89,46.97 90.09,48.05 v90.09,48.41 | R13.1 105.7,23.12 J20.8
  Bottom 0.203: v74.55,42.45 75.1,43 76,43 79.47,46.47 85.5,46.47 86,46.97 v89,46.97 | v90.09,48.41 90.59,47.91 93.41,47.91 95.5,50 101.5,50 102.59,48.91 102.59,47.91 108.21,42.29 J20.8
E3_STEP  (via drill 0.35)
  Top 0.203: U1.7 75.4,41.91 74.67,41.17 73.28,41.17 v73.05,40.95 | v90.64,45.86 90.66,45.87 v92.52,45.87
  Bottom 0.203: v73.05,40.95 73.28,41.17 75.18,41.17 79.51,45.5 90.28,45.5 v90.64,45.86 | v92.52,45.87 95.02,43.37 105.13,43.37 107.5,41 107.5,36 98.94,27.44 94.78,27.44 J20.2
E3_UART  (via drill 0.35)
  Top 0.203: U1.6 75.3,42.3 74.81,41.82 v73.92,41.82 v73.91,41.81 | v90,46.5 90.72,47.22 v91.39,47.22
  Bottom 0.203: v73.91,41.81 v73.92,41.82 75.32,41.82 79.5,46 89.5,46 v90,46.5 | v91.39,47.22 93.39,47.22 95.39,49.22 100.28,49.22 107.86,41.64 107.86,26.96 107.02,26.13 107.02,24.52 103.05,20.55 J19.5
FS0  (via drill 0.35)
  Top 0.203: U1.4 73.11,43.1 v72.79,42.78 | v58.5,55 55.5,55 v54,56.5 | FS0.P$1 v116.5,38.5 | v75,72 35,72 v30,67
  Bottom 0.203: v72.79,42.78 72.42,43.16 68.11,43.16 58.5,52.77 v58.5,55 | v54,56.5 32.54,56.5 X6.3 30,60.96 v30,67 | v116.5,38.5 116.52,38.52 116.87,38.52 116.88,38.54 116.88,62.12 114.36,64.64 114.36,65.15 112,67.5 112,70.5 110,72.5 75.5,72.5 v75,72
FS1  (via drill 0.35)
  Top 0.203: X8.3 59.5,57.29 59.5,55.39 68.89,46 69,46 69.5,45.5 69.5,44.53 v67.27,42.3 | v71,41.87 71,40.87 71.91,39.96 74.47,39.96 75,40.5 76.09,40.5 76.69,41.09 U1.9 | FS1.P$1 115.5,37 v115.5,38.5 | v115.5,61.5 111,66 v111,66.5 | v102.5,69 102.13,69.37 101.74,69.37 99.24,71.87 v90.5,71.87 | v76,69 72,69 v71.5,69.5 | v64.5,68 63,68 v60,71
  Bottom 0.203: v71,41.87 70.57,42.3 v67.27,42.3 | v115.5,38.5 115.5,40.45 116.51,41.46 116.51,43.18 116.5,43.2 116.5,47.98 116.51,47.99 116.51,60.49 v115.5,61.5 | v111,66.5 105,66.5 v102.5,69 | v90.5,71.87 86.63,68 76.5,68 76,68.5 v76,69 | v71.5,69.5 67.64,69.5 66.53,68.39 64.89,68.39 v64.5,68 | v60,71 56.78,67.78 X8.3
FS2  (via drill 0.35)
  Top 0.203: v93.5,35 89,35 87.7,36.3 84.31,36.3 83.4,37.21 83.4,38.31 U1.27 | v95.94,37.41 102.39,43.87 v108,43.87 | v106,55 100,55 97.5,57.5 86,57.5 84.54,58.96 X7.3 | FS2.P$1 112,38 v112,42
  Bottom 0.203: v95.94,37.41 93.52,35 v93.5,35 | v106,55 108,53 v108,43.87 110.13,43.87 v112,42
FS3  (via drill 0.35)
  Top 0.203: U1.28 83.87,38.24 83.87,37.24 84.24,36.87 92.13,36.87 v93,36 | v95.14,38.04 101.61,44.5 v109,44.5 | FS3.P$1 113,34.5 v113,35.5
  Bottom 0.203: v95.14,38.04 93.11,36 v93,36 | X9.3 112.54,53.54 109,50 v109,44.5 109.11,44.5 109.24,44.37 111.13,44.37 113,42.5 v113,35.5
GND  (via drill 0.35)
  Top 0.203: U1.19 80.15,36.7 v79.92,36.47 80.2,36.19 80.2,35.3 82.53,32.96 C1.2 | v80.04,40.56 81.15,41.68 | v12,57 10.73,55.73 R14.2 12.73,54.12 17.61,54.12 R31.1 16.5,49.41 16.5,41.5 13.5,38.5 12,38.5 11.6,38.1 C39.1 11.39,37 v10.5,37 | v12.5,36 12.5,34.76 RESET.1 BOOT.1 12.06,29.83 12.13,29.76 12.13,29.24 12,29.11 12,28 11.14,27.15 11.14,22.64 | C17.2 47.39,48.32 C15.2 48.56,49.31 v48.5,49.37 | P2.2 52.09,48.41 v52,48.5 52.56,49.06 53.42,49.06 53.86,49.5 55.5,49.5 56.46,48.54 C14.2 56.46,47.22 C16.2 | R18.1 51.95,59.76 X8.1 | R17.2 43.93,52.07 47.19,48.81 C17.2 | D3.C v46,44.96 46,47.5 46.62,48.12 C17.2 | v47,42 46.56,42.44 45.77,42.44 45.42,42.79 U3.2 43.66,42.5 v42.5,42.5 | C19.2 51.22,34.85 C18.2 51.31,37 R6.1 52.1,37.08 v52.27,36.91 | v59.5,38 59.65,38 60.39,37.27 60.39,37.22 R9.1 61.58,37.76 C21.2 64.5,37.99 64.5,39 65,39.5 68,39.5 69.54,37.96 C22.2 70.74,38.57 C7.2 | P1.1 54,37.45 v54,38 | C28.2 40.33,37.7 C27.2 38.7,39.83 38.7,41.5 | 38.7,41.5 U3.8 | v40,41.5 38.7,41.5 | C7.2 71.38,35.72 C8.2 70.44,35.57 v70,35.13 | C12.2 86.97,35.14 C6.2 87.69,33.71 89.06,33.71 90.67,32.1 90.67,30.42 89.97,29.72 89.97,29.65 | C1.2 85.44,31.05 X1.P$4 | X1.P$2 88,29.65 | 88,29.65 89.97,29.65 | 89.97,29.65 C2.1 94,33.68 v94,34 | C1.2 81.5,30.02 81.5,29.01 82,28.51 87,28.51 88,29.51 88,29.65 | C9.2 v96.5,41 96.36,41.14 96.36,47.19 93.69,49.86 87.64,49.86 86.5,51 v85.5,51 85.5,49.47 C11.2 86.57,49.19 C10.2 | v95.15,42.17 94.41,41.43 C5.2 | R21.2 100.1,52.4 100.88,51.62 99.5,50.23 v99.5,48 | R22.1 107.53,54 101.15,54 R21.2 | X7.1 78.5,60 77,58.5 77,57.11 77.74,56.37 77.98,56.37 R20.1 79.95,53.06 C3.2
  Top 0.203: C3.2 78.45,52.48 C4.2 75.96,51.91 C24.2 75.52,53.48 v75,54 | R19.2 69.83,54 v72.5,54 | R22.1 107.46,54.07 X9.1 | USB.12 114.25,49.8 USB.24 114.12,53.38 112,55.5 109.62,55.5 108.93,54.8 108.93,52.6 R22.1 | USB.1 114.25,41.41 USB.20 | C13.2 91.5,48.09 v91.5,48.55 | U2.4 66.64,42.09 66.64,42.04 67.81,40.87 v69,40.87 | v70.99,39.99 71.38,39.6 C7.2 | C3.2 84.3,52.48 84.65,52.84 94.16,52.84 95.5,51.5 99,51.5 99.55,52.05 R21.2 | J25.2 111.57,21.07 110.5,20 104.76,20 C30.- 102.82,17.82 | 102.82,17.82 105.67,14.97 J21.7 | 102.82,17.82 102.82,16.82 101,15 98.51,15 97.79,14.28 91.78,14.28 J21.1 90.43,11.93 88.5,10 83,10 81.14,11.86 J15.7 77.17,16.9 C29.- 77.17,16.17 76,15 73.24,15 72.53,14.3 67.27,14.3 J15.1 62.97,10 56.5,10 54.84,11.66 J6.7 50.87,16.9 | 50.87,16.9 50.87,16.37 49.5,15 47.57,15 46.86,14.3 40.97,14.3 J6.1 37.67,11 31.1,11 J4.7 26.5,15.6 26.5,17.5 26,18 25.19,18 C25.- 25.19,17.69 21.63,14.13 18.51,14.13 17.81,13.43 17.81,12.6 16.96,11.75 15.97,11.75 14.77,12.94 J4.1 11.14,15.72 11.14,22.64 | 50.87,16.9 C26.- | v41,57.13 38.73,54.87 R17.2 | X6.1 23.96,61.96 25,63 30.5,63 34.5,59 34.5,53 36.5,51 38,51 38.73,51.73 R17.2 | v81.13,40.56 81.15,40.59 81.15,41.6 | 81.15,41.68 81.15,41.6 | 81.15,41.6 v82.18,40.58 | U1.57 81.09,41.65 v80.02,41.65 | U1.57 81.07,41.7 v80.04,42.73 | v81.17,42.76 81.15,42.74 81.15,41.74 | 81.15,41.74 v82.14,42.72 | v82.17,41.62 82.08,41.7 U1.57 | U1.57 81.15,41.74 | U1.57 81.15,41.68 | GND.P$1 3.5,16.5 9.5,22.5 11,22.5 11.14,22.64 | D2.2 99.8,46.2 v99.5,46.5
  Bottom 0.203: v80.04,40.56 80.54,40.06 80.54,37.09 v79.92,36.47 78.45,35 74.39,35 74.26,34.87 70.26,34.87 v70,35.13 | X6.1 23.96,59.46 21.5,57 v12,57 | v10.5,37 11.5,36 v12.5,36 | v48.5,49.37 51.13,49.37 v52,48.5 | v47,42 46,43 v46,44.96 45.46,44.96 45,44.5 45,41.61 48.74,37.87 51.31,37.87 v52.27,36.91 53.23,37.87 53.76,37.87 53.89,38 v54,38 v59.5,38 | v42.5,42.5 41.5,41.5 v40,41.5 | v95.15,42.17 96.33,41 v96.5,41 97,40.5 97,37 v94,34 | v72.5,54 v75,54 82.5,54 v85.5,51 89.05,51 v91.5,48.55 | v69,40.87 70.11,40.87 v70.99,39.99 | X8.1 48.82,57.13 v41,57.13 | v99.5,46.5 v99.5,48
  other vias: 81.11,41.69 8,23.5 9.5,25.5 8,17.5 7.5,14.5 12,6 11,3.5 13,3.5 31,2.5 34.5,3.5 33.5,9.5 38,9.5 39,5 40.5,2 40,17.5 39,22 5,29.5 5,37 16,36.5 19,36 24,40 6,49.5 11.5,49 15,50 24.5,46.5 31,46.5 31.5,40.5 35.5,45.5 41,48.5 35.5,40.5 36,36 20,30.5 66.5,6.5 64.5,8.5 63,12.5 62.5,17.5 64,23 89,6 89.5,8 91,10 85,20.5 88,19 90,20 87,23.5 90,23.5 98,30.5 115.5,27.5 113.5,31 106,48.5 104,52 118.5,54.5 118.5,61.5 110.5,64.5 107.5,65 60,64 53.5,64 32.5,63 23,64 3.5,53 3.5,57 34.5,69.5 45.5,70.5 47.5,69.5 62,70.5 72.5,70.5 99.5,70 99,39 102,42 106.72,45.15 112,45 115.5,44.5 99.9,44.16 105,36.5 101.5,33.5 101,36.5 6.5,44 40.5,53.5 46.5,53.5 62.5,54.5 67,54.5 58,45 58,42 114,9.5 111,2 17.5,71 21.5,69 31.5,70.5 86,70 90,69
  pour Top (rank 3): -1,75.5 121,75.5 121,73 121,-1 119,-1 -1,-1 -1,0.5
  pour Bottom (rank 3): -1,76 121,76 121,-1 -1,-1
LDOLED
  Top 0.203: R15.1 48.11,44.35 D3.A
LOAD_0  (via drill 0.35)
  Top 0.203: U1.11 76.9,40.3 75.45,38.85 v74.92,38.85 | v56.5,51.5 52,51.5 51,52.5 v51,55.87 | LOAD0.1 7.73,67.76 X18.1 7.73,54.26 R14.1 6.88,52.12 LOAD_0.P$1
  Bottom 0.203: v56.5,51.5 58.5,51.5 66.37,43.63 66.37,42.31 67.18,41.5 70.47,41.5 70.74,41.24 71.26,41.24 72.65,39.85 74.42,39.85 74.92,39.35 v74.92,38.85 | v51,55.87 10.13,55.87 7.73,58.27 X18.1
LOAD_1  (via drill 0.35)
  Top 0.203: X22.1 35.73,58 37.87,55.86 v37.87,54.37 R17.1 | v36,69.5 36.66,70.16 LOAD1.1 | v52.5,53.13 52.5,52.5 53.14,51.86 55.86,51.86 56.46,52.46 57.5,52.46 v57.5,49.5 | v73.5,36.5 74.48,37.48 75.14,37.48 77.16,39.51 U1.13 | LOAD_1.P$1 3.5,45.5 v4,45
  Bottom 0.203: X22.1 35.73,69.23 v36,69.5 | v37.87,54.37 38,54.37 | 38,54.37 51.63,54.37 52.5,53.5 v52.5,53.13 | v57.5,49.5 57.5,49.1 69.73,36.87 73.13,36.87 v73.5,36.5 | 38,54.37 37.87,54.5 28,54.5 21.14,47.65 21.14,42.14 20,41 7.5,41 4,44.5 v4,45
LOAD_2  (via drill 0.35)
  Top 0.203: U1.15 77.7,37.5 v77,37.5 | v59.24,48.76 61.5,51.02 v61.5,51.5 | v63,53 64.1,51.9 R19.1 63.23,55.54 X20.1 | v63.5,71 64.32,70.18 LOAD2.1 | LOAD_2.P$1 2.5,40.5 2.5,62.5 v5.5,65.5
  Bottom 0.203: v77,37.5 74.5,37.5 73.82,38.18 69.49,38.18 59.24,48.43 v59.24,48.76 | v61.5,51.5 v63,53 | X20.1 63.23,70.73 v63.5,71 62,72.5 12.4,72.5 10.7,70.8 10.7,70.7 v5.5,65.5
LOAD_3  (via drill 0.35)
  Top 0.203: U1.17 79.35,37.76 78.09,36.5 v78.09,36 80.5,33.59 80.5,32.5 80,32 80,28 80.2,27.8 88.75,27.8 89.02,28.07 92.07,28.07 93,29 93,29.13 v94.37,30.5 | LOAD3.1 92,70 v91.5,69.5 88,73 4.5,73 1.79,70.29 1.79,32.71 LOAD_3.P$1 | v91.5,56.87 95.97,52.4 R21.1 98.58,52.5 v96,52.5 | v97.5,42.5 97.5,46.79 93.47,50.82 v92.56,50.82
  Bottom 0.203: v91.5,69.5 91.23,69.23 X24.1 91.5,59.73 v91.5,56.87 | v94.37,30.5 98,34.13 98,42 v97.5,42.5 | v92.56,50.82 94.32,50.82 v96,52.5
MS1_0
  Bottom 0.203: J3.7 29.16,21.16 22.13,14.13 19,14.13 17.99,15.15 J1.2
MS1_1  (via drill 0.35)
  Top 0.203: J2.2 43.99,15.49 45.34,16.84 46.86,16.84 49.13,19.1 49.13,20.63 v50,21.5
  Bottom 0.203: J5.7 50.7,21.5 v50,21.5
MS1_2  (via drill 0.35)
  Top 0.203: J13.2 70.85,16.84 72.53,16.84 75,19.3 v75,22
  Bottom 0.203: J14.7 77.5,22 v75,22
MS1_3  (via drill 0.35)
  Top 0.203: v109.5,28.5 108.54,28.5 J20.7
  Bottom 0.203: J19.2 96.1,16.82 96.1,18.51 96.8,19.21 103.47,19.21 109.41,25.14 109.41,28.41 v109.5,28.5
MS2_0
  Top 0.203: J1.4 18.84,18.02 20.03,16.83 21.02,16.83 23.5,19.31 23.5,23.5 24.47,24.47 24.58,24.47 25.77,25.66 J3.6
MS2_1  (via drill 0.35)
  Top 0.203: v48.5,19.94 48.5,22.31 v50,23.81
  Bottom 0.203: v48.5,19.94 47.43,19.94 46.86,19.38 45.18,19.38 J2.4 | v50,23.81 51.83,25.64 J5.6
MS2_2
  Bottom 0.203: J13.4 70.85,19.38 70.85,21.06 71.55,21.76 73.23,21.76 75.47,24 77.5,24 78.6,25.1 J14.6
MS2_3
  Bottom 0.203: J20.6 99.25,21.75 96.8,21.75 96.1,21.05 96.1,19.36 J19.4
MS3_0
  Top 0.203: J3.5 22.86,24.44 22.86,21.2 21.02,19.37 20.03,19.37 18.84,20.56 J1.6
MS3_1
  Bottom 0.203: J5.5 48.5,24.38 48.5,23.5 46.76,21.76 45.88,21.76 44.68,20.57 J2.6
MS3_2
  Bottom 0.203: J13.6 70.85,21.92 70.85,23.6 71.69,24.45 74.01,24.45 74.07,24.5 75,24.5 76.06,25.56 J14.5
MS3_3
  Bottom 0.203: J20.5 99.83,25.63 98.48,24.29 96.8,24.29 96.1,23.59 96.1,21.9 J19.6
OSC_IN
  Top 0.203: U1.20 80.55,35.45 82.81,33.19 R4.2 85.52,32.98 86.29,32.21 86.55,32.21 86.94,31.82 86.94,30.82 86.57,30.45 86.54,30.45 X1.P$1 85.59,29.5 85.5,29.5 85.05,29.95 C1.1
OSC_OUT
  Top 0.203: R3.2 86.45,33.19 | 86.45,33.19 R4.1 | U1.21 80.95,35.59 82.8,33.74 85.89,33.74 86.45,33.19
QSPI_SCK  (via drill 0.35)
  Top 0.203: U1.52 80.15,46.8 77.12,49.84 v76.21,49.84 | U2.6 72.31,45.31 73.5,46.5 v73.5,47
  Bottom 0.203: v76.21,49.84 73.5,47.12 v73.5,47
QSPI_SD0  (via drill 0.35)
  Top 0.203: U1.53 79.75,46.6 77.25,49.1 v76.83,49.1 | v73.5,45.5 73.33,45.5 U2.5
  Bottom 0.203: v76.83,49.1 73.5,45.77 v73.5,45.5
QSPI_SD1  (via drill 0.35)
  Top 0.203: U1.55 78.95,46.05 77.71,47.29 v77.49,47.29 | v67,46.5 64.77,46.5 U2.2
  Bottom 0.203: v77.49,47.29 74.28,44.08 68.49,44.08 67,45.57 v67,46.5
QSPI_SD2  (via drill 0.35)
  Top 0.203: U1.54 79.35,46.4 77.54,48.22 v77.12,48.22 | v68,45.5 64.87,45.5 U2.3
  Bottom 0.203: v77.12,48.22 77.12,48.03 73.59,44.5 71,44.5 70,45.5 v68,45.5
QSPI_SD3  (via drill 0.35)
  Top 0.203: U1.51 80.55,46.95 77,50.5 v75.5,50.5 | v73.5,49 73.5,48 72.08,46.59 U2.7
  Bottom 0.203: v73.5,49 74,49 v75.5,50.5
QSPI_SS  (via drill 0.35)
  Top 0.203: U1.56 78,45.61 v78,46 | v66.5,47.5 66.14,47.85 U2.1 64.69,49.35 61.22,52.81 53.81,52.81 v53.5,52.5 | R23.1 14.44,29.9 R24.1 14.66,31.5 v16.5,31.5
  Bottom 0.203: v78,46 76.7,46 74.22,43.51 68.26,43.51 66.64,45.13 66.64,45.86 66,46.5 66,47 v66.5,47.5 | v53.5,52.5 26.5,52.5 21.5,47.5 21.5,34.5 18.5,31.5 v16.5,31.5
RESET  (via drill 0.35)
  Top 0.203: U1.26 82.95,36.52 v83.5,35.97 | R25.1 14,34.91 14,36 12.79,37.21 | 12.79,37.21 C39.2 | v32.5,27.5 33,27 49,27 49.5,27.5 76.4,27.5 79.53,30.63 v79.53,33.63 | v7,34 7.32,34.32 RESET.2 9.02,34.78 9.02,34.85 10.17,36 11.58,36 12.79,37.21
  Bottom 0.203: v83.5,35.97 83.5,35.79 81.34,33.63 v79.53,33.63 | v7,34 9.02,31.98 9.02,30.63 12.15,27.5 v32.5,27.5
RST_0
  Top 0.203: J3.4 J3.3 17.99,24.65 J1.8
RST_1
  Bottom 0.203: J5.4 J5.3 43.83,24.79 J2.8
RST_2
  Bottom 0.203: J14.4 J14.3 69.5,24.16 J13.8
RST_3
  Bottom 0.203: J20.4 J20.3 94.75,24.87 J19.8
SWB  (via drill 0.35)
  Top 0.203: R23.2 14.08,28.13 v13.53,28.13 | v11.5,29.5 9,29.5 8.56,29.94 BOOT.2
  Bottom 0.203: v13.53,28.13 12.16,29.5 v11.5,29.5
UNLOAD_0  (via drill 0.35)
  Top 0.203: U1.12 77.05,39.9 74.99,37.84 73.34,37.84 v73,37.5 | v56.5,50.5 55.86,51.14 51.85,51.14 50.64,52.35 50.64,54.72 v50.37,55 | v23.5,54.5 22.45,54.5 R31.2 | v19.5,70 19.77,70.27 UNLOAD0.1 | UNLOAD_0.P$1 16,51.5 16.5,52 v16.5,53
  Bottom 0.203: v73,37.5 69.6,37.5 58.13,48.97 58.13,49.76 57.39,50.5 v56.5,50.5 | v50.37,55 24,55 v23.5,54.5 23.5,53.5 23,53 v16.5,53 9,53 2.5,59.5 2.5,61.5 4,63 12.73,63 X19.1 15.73,66.23 v19.5,70
UNLOAD_1  (via drill 0.35)
  Top 0.203: v74,35.5 74,35.8 77.3,39.1 U1.14 | v58,47.5 58,48.5 60.5,51 60.5,51.68 v60,52.18 | v61,55 60,56 60,61 58.5,62.5 54.5,62.5 | 54.5,62.5 52.81,60.81 R18.2 | 54.5,62.5 50.5,62.5 v49,64 | v49.5,70 49.67,70.17 UNLOAD1.1 | v15.5,42 15.13,41.63 15.13,40.74 14.76,40.37 5.63,40.37 3.5,42.5 UNLOAD_1.P$1 | v23,51 25,49 v33.5,49 | v46,51.5 43.73,53.77 X23.1
  Bottom 0.203: v74,35.5 70.6,35.5 63.1,43 62.5,43 v58,47.5 | v60,52.18 60,54 v61,55 | X23.1 43.73,61.23 46.5,64 v49,64 49,69.5 v49.5,70 | v15.5,42 19,45.5 19,48 22,51 v23,51 | v33.5,49 36,51.5 v46,51.5
UNLOAD_2  (via drill 0.35)
  Top 0.203: v77.18,36.6 77.32,36.6 78.46,37.75 78.75,37.75 78.95,37.95 U1.16 | v60.28,48.28 60.28,48.78 v62,50.5 | v69.5,55 69.5,58.27 X21.1 | R20.2 80.48,54.73 80.48,54.77 78.26,57 v78,57 | v75.5,70 75.67,70.17 UNLOAD2.1 | UNLOAD_2.P$1 3.5,36.42 2.14,37.78 2.14,63.64 v4.5,66
  Bottom 0.203: v77.18,36.6 78.08,37.5 78.59,37.5 79,37.91 79,39 78.49,39.5 78,39.5 76.5,38 74.5,38 73.96,38.54 69.64,38.54 66.01,42.16 66.01,42.55 v60.28,48.28 | v62,50.5 64.5,53 67.5,53 v69.5,55 | X21.1 73.23,62 | 73.23,62 75.5,62 78,59.5 v78,57 | 73.23,62 73.23,67.73 v75.5,70 72.5,73 12.36,73 6.13,66.77 5.27,66.77 v4.5,66
UNLOAD_3  (via drill 0.35)
  Top 0.203: U1.18 79.75,37.25 79.5,37 v79,36.5 79.29,36.21 79.29,35.34 81,33.63 81,28.66 81.5,28.16 88.6,28.16 88.87,28.42 91.33,28.42 94,31.09 v94,32 | UNLOAD3.1 102.08,70.08 v102,70 98.5,73.5 4.5,73.5 4.36,73.36 4.35,73.36 1.43,70.44 1.43,29.49 3.5,27.42 UNLOAD_3.P$1 | v97.34,35.98 104.36,43 108.5,43 v110.5,45 | v110.5,50 110.5,51.89 R22.2
  Bottom 0.203: X25.1 99.23,67.23 v102,70 105.78,70 106.98,68.79 110.21,68.79 114,65 114,53.5 v110.5,50 v110.5,45 | v94,32 97.34,35.34 v97.34,35.98
USB1_N  (via drill 0.35)
  Top 0.203: 90,52 v90,51 | D2.3 D2.4 | v87.5,54 85,56.5 v85,57 | v88,66.5 88,69.46 IO2.P$1
  Top 0.254: USB.5 113.65,44.85 113.42,45.08 113.42,45.62 113.65,45.85 USB.7 113.24,45.85 113.22,45.87 104.5,45.87 103.83,45.2 102.16,45.2 D2.4 | D2.3 99.15,45.7 92.85,52 90,52 85,52 83.49,50.49 R30.1
  Bottom 0.203: v90,51 87.5,53.5 v87.5,54 | v85,57 88,60 v88,66.5
USB1_P  (via drill 0.35)
  Top 0.203: 82.93,50.57 82.5,51 v82.5,51.5 | v82,53.12 83.66,54.78 83.66,58.34 83.5,58.5 v83.47,58.48 | D2.1 D2.6 | IO1.P$1 84.5,69.42 v84.5,67
  Top 0.254: USB.6 114.85,45.35 115.08,45.58 115.08,46.12 114.85,46.35 USB.8 113.24,46.35 113.22,46.33 104.36,46.33 103.99,46.7 D2.6 | D2.1 99.84,47.2 98.8,47.2 93.54,52.46 84.81,52.46 82.93,50.57 82.24,49.89 R29.1
  Bottom 0.203: v82.5,51.5 82.5,52.62 v82,53.12 | v83.47,58.48 83.47,65.97 v84.5,67
USB_N
  Top 0.203: R30.2 83.49,47.83 82.56,46.9 82.56,45.92 U1.46
USB_P
  Top 0.203: U1.47 82.15,45.75 82.15,48.3 R29.2
VBUS
  Top 0.508: USB.11 116.05,47.95 117,47 117,44 116.5,43.5 115.32,43.5 115.07,43.25 USB.2 112.75,43.25 112.5,43.5 110,43.5 109.49,42.99 109.49,42.93 SJ3.2
VBUS1  (via drill 0.35)
  Top 0.203: v106.5,39 109.42,39 F1.2 109.49,38.94 SJ3.1 | D2.5 102.3,46.2 v102.5,46 | v98.5,44.5 v98.5,42.5
  Bottom 0.203: v98.5,42.5 102,39 v106.5,39 | v102.5,46 101.5,45 99,45 v98.5,44.5
VBUS3
  Top 0.508: F1.1 109.54,36.46 110,36 110,33.59 D1.2
VRC
  Top 0.203: R8.2 60.56,33.54 C23.1 61.72,33.8 R7.1
VREGEN  (via drill 0.35)
  Top 0.203: P1.5 56.91,36.09 v54,39 | R6.2 50.55,37.95 v50,38.5 47.44,35.94 R5.1
  Bottom 0.203: v54,39 50.5,39 v50,38.5
VREGFB
  Top 0.203: P1.4 59.61,35.14 R8.1 | R8.1 59.85,35.38 R9.2 | R8.1 59.7,33.31 C23.2
VREGO
  Top 0.203: C20.2 62,41 62,42 61.55,42.45 L1.1 58.7,41 52,41 51.5,40.5 51.5,39.5 53,38 53,36.5 53.41,36.09 P1.2
XR
  Top 0.203: R3.1 88.67,32.08 X1.P$3 89.71,31.35 C2.2

## Text on the board
tNames: DP | DN | LOAD_0 | LOAD_0 | UNLOAD_0 | FS0 | LOAD_1 | UNLOAD_1 | FS1 | LOAD_2 | UNLOAD_2 | FS2 | LOAD_3 | UNLOAD_3 | FS3 | UNLOAD_0 | LOAD_1 | UNLOAD_1 | CAN_L | CAN_H | LOAD_2 | UNLOAD_2 | FS0 | FS1 | LOAD_3 | Multi Extruder Board V1 | Designed by Nishant Bilurkar | FS2 | UNLOAD_3 | FS3 | POWER | GND | +24V | +5V | +3.3V | GND | +24V | M0 | M1 | M2 | M3 | B1 _0 | A1 _0 | A2 _0 | B2 _0 | B1 _1 | A1 _1 | A2 _1 | B2 _1 | B1 _2 | A1 _2 | A2 _2 | B2 _2 | B1 _3 | A1 _3 | A2 _3 | B2 _3
bNames: GND | +24V